# EAGLE design 156-01A LCNC Combo board (EAGLE 6.6.0)

## Sheet 1 of 2
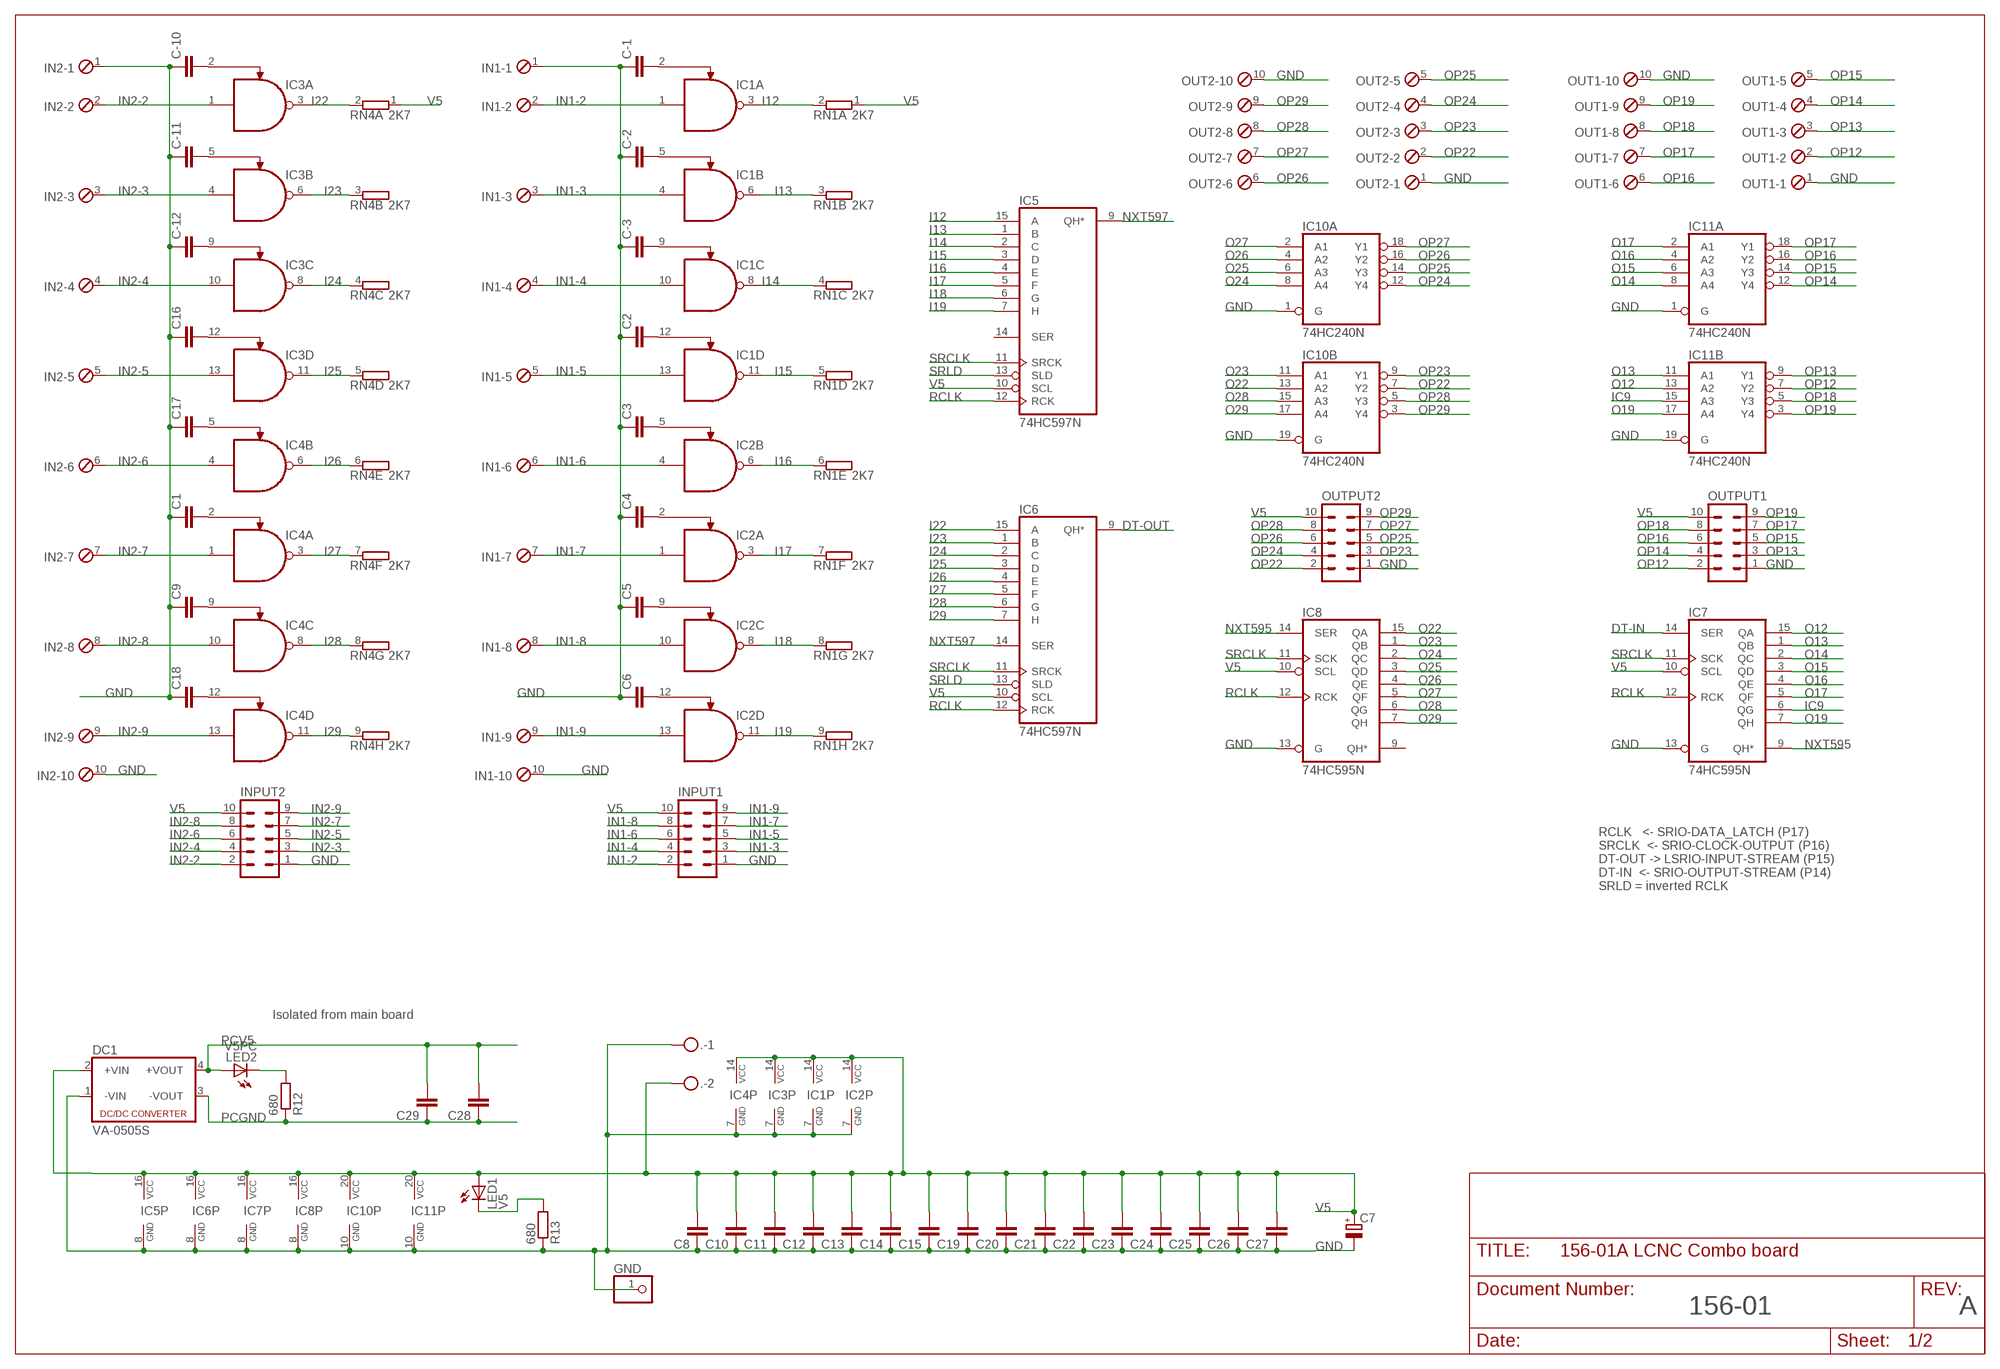
[diagram p0: schematic, sheet 1]

### Parts
.  MKDSN1,5/2-5,08  [MKDSN1,5/2-5,08]
C1  C-EU025-024X044  [C025-024X044]
C2  C-EU025-024X044  [C025-024X044]
C3  C-EU025-024X044  [C025-024X044]
C4  C-EU025-024X044  [C025-024X044]
C5  C-EU025-024X044  [C025-024X044]
C6  C-EU025-024X044  [C025-024X044]
C7  CPOL-EUE3.5-8  [E3,5-8]
C8  C-EU025-024X044  [C025-024X044]
C9  C-EU025-024X044  [C025-024X044]
C10  C-EU025-024X044  [C025-024X044]
C11  C-EU025-024X044  [C025-024X044]
C12  C-EU025-024X044  [C025-024X044]
C13  C-EU025-024X044  [C025-024X044]
C14  C-EU025-024X044  [C025-024X044]
C15  C-EU025-024X044  [C025-024X044]
C16  C-EU025-024X044  [C025-024X044]
C17  C-EU025-024X044  [C025-024X044]
C18  C-EU025-024X044  [C025-024X044]
C19  C-EU025-024X044  [C025-024X044]
C20  C-EU025-024X044  [C025-024X044]
C21  C-EU025-024X044  [C025-024X044]
C22  C-EU025-024X044  [C025-024X044]
C23  C-EU025-024X044  [C025-024X044]
C24  C-EU025-024X044  [C025-024X044]
C25  C-EU025-024X044  [C025-024X044]
C26  C-EU025-024X044  [C025-024X044]
C27  C-EU025-024X044  [C025-024X044]
C28  C-EU025-024X044  [C025-024X044]
C29  C-EU025-024X044  [C025-024X044]
C-1  C-EU025-024X044  [C025-024X044]
C-2  C-EU025-024X044  [C025-024X044]
C-3  C-EU025-024X044  [C025-024X044]
C-10  C-EU025-024X044  [C025-024X044]
C-11  C-EU025-024X044  [C025-024X044]
C-12  C-EU025-024X044  [C025-024X044]
DC1  VA-0505S  [4SIL]
GND  PINHD-1X1  [1X01]
IC1  MC1489DIP  [DIL14]
IC2  MC1489DIP  [DIL14]
IC3  MC1489DIP  [DIL14]
IC4  MC1489DIP  [DIL14]
IC5  74HC597N  [DIL16]
IC6  74HC597N  [DIL16]
IC7  74HC595N  [DIL16]
IC8  74HC595N  [DIL16]
IC10  74HC240N  [DIL20]
IC11  74HC240N  [DIL20]
IN1  MPT10  [10POL254]
IN2  MPT10  [10POL254]
INPUT1  ML10  [ML10]
INPUT2  ML10  [ML10]
LED1  V5  LED3MM  [LED3MM]
LED2  V5PC  LED3MM  [LED3MM]
OUT1  MPT10  [10POL254]
OUT2  MPT10  [10POL254]
OUTPUT1  ML10  [ML10]
OUTPUT2  ML10  [ML10]
R12  680  R-EU_0207/10  [0207/10]
R13  680  R-EU_0207/10  [0207/10]
RN1  2K7  GE08R  [SIL9]
RN4  2K7  GE08R  [SIL9]

### Nets
DT-IN: IC7.14(SER) ; also sheet 2
DT-OUT: IC6.9(QH*) ; also sheet 2
GND: ..1 C1.1 C2.1 C3.1 C4.1 C5.1 C6.1 C7.- C8.1 C9.1 C10.1 C11.1 C12.1 C13.1 C14.1 C15.1 C16.1 C17.1 C18.1 C19.1 C20.1 C21.1 C22.1 C23.1 C24.1 C25.1 C26.1 C27.1 C-1.1 C-2.1 C-3.1 C-10.1 C-11.1 C-12.1 DC1.1(-VIN) GND.1 IC1.7(P:GND) IC2.7(P:GND) IC3.7(P:GND) IC4.7(P:GND) IC5.8(GND) IC6.8(GND) IC7.8(GND) IC7.13(G) IC8.8(GND) IC8.13(G) IC10.1(A:G) IC10.10(P:GND) IC10.19(B:G) IC11.1(A:G) IC11.10(P:GND) IC11.19(B:G) IN1.1 IN1.10 IN2.1 IN2.10 INPUT1.1 INPUT2.1 OUT1.1 OUT1.10 OUT2.1 OUT2.10 OUTPUT1.1 OUTPUT2.1 R13.1 ; also sheet 2
I12: IC1.3(A:O) IC5.15(A) RN1.2
I13: IC1.6(B:O) IC5.1(B) RN1.3
I14: IC1.8(C:O) IC5.2(C) RN1.4
I15: IC1.11(D:O) IC5.3(D) RN1.5
I16: IC2.6(B:O) IC5.4(E) RN1.6
I17: IC2.3(A:O) IC5.5(F) RN1.7
I18: IC2.8(C:O) IC5.6(G) RN1.8
I19: IC2.11(D:O) IC5.7(H) RN1.9
I22: IC3.3(A:O) IC6.15(A) RN4.2
I23: IC3.6(B:O) IC6.1(B) RN4.3
I24: IC3.8(C:O) IC6.2(C) RN4.4
I25: IC3.11(D:O) IC6.3(D) RN4.5
I26: IC4.6(B:O) IC6.4(E) RN4.6
I27: IC4.3(A:O) IC6.5(F) RN4.7
I28: IC4.8(C:O) IC6.6(G) RN4.8
I29: IC4.11(D:O) IC6.7(H) RN4.9
IC9: IC7.6(QG) IC11.15(B:A3)
IN1-2: IC1.1(A:I0) IN1.2 INPUT1.2
IN1-3: IC1.4(B:I0) IN1.3 INPUT1.3
IN1-4: IC1.10(C:I0) IN1.4 INPUT1.4
IN1-5: IC1.13(D:I0) IN1.5 INPUT1.5
IN1-6: IC2.4(B:I0) IN1.6 INPUT1.6
IN1-7: IC2.1(A:I0) IN1.7 INPUT1.7
IN1-8: IC2.10(C:I0) IN1.8 INPUT1.8
IN1-9: IC2.13(D:I0) IN1.9 INPUT1.9
IN2-2: IC3.1(A:I0) IN2.2 INPUT2.2
IN2-3: IC3.4(B:I0) IN2.3 INPUT2.3
IN2-4: IC3.10(C:I0) IN2.4 INPUT2.4
IN2-5: IC3.13(D:I0) IN2.5 INPUT2.5
IN2-6: IC4.4(B:I0) IN2.6 INPUT2.6
IN2-7: IC4.1(A:I0) IN2.7 INPUT2.7
IN2-8: IC4.10(C:I0) IN2.8 INPUT2.8
IN2-9: IC4.13(D:I0) IN2.9 INPUT2.9
N$1: C-2.2 IC1.5(B:I1)
N$3: C-10.2 IC3.2(A:I1)
N$5: C17.2 IC4.5(B:I1)
N$7: C-3.2 IC1.9(C:I1)
N$10: C1.2 IC4.2(A:I1)
N$11: C9.2 IC4.9(C:I1)
N$12: C18.2 IC4.12(D:I1)
N$19: C2.2 IC1.12(D:I1)
N$20: C4.2 IC2.2(A:I1)
N$21: C5.2 IC2.9(C:I1)
N$22: C6.2 IC2.12(D:I1)
N$23: C-1.2 IC1.2(A:I1)
N$24: C3.2 IC2.5(B:I1)
N$27: LED2.K(C) R12.2
N$28: LED1.K(C) R13.2
N$39: C-11.2 IC3.5(B:I1)
N$40: C-12.2 IC3.9(C:I1)
N$42: C16.2 IC3.12(D:I1)
NXT595: IC7.9(QH*) IC8.14(SER)
NXT597: IC5.9(QH*) IC6.14(SER)
O12: IC7.15(QA) IC11.13(B:A2)
O13: IC7.1(QB) IC11.11(B:A1)
O14: IC7.2(QC) IC11.8(A:A4)
O15: IC7.3(QD) IC11.6(A:A3)
O16: IC7.4(QE) IC11.4(A:A2)
O17: IC7.5(QF) IC11.2(A:A1)
O19: IC7.7(QH) IC11.17(B:A4)
O22: IC8.15(QA) IC10.13(B:A2)
O23: IC8.1(QB) IC10.11(B:A1)
O24: IC8.2(QC) IC10.8(A:A4)
O25: IC8.3(QD) IC10.6(A:A3)
O26: IC8.4(QE) IC10.4(A:A2)
O27: IC8.5(QF) IC10.2(A:A1)
O28: IC8.6(QG) IC10.15(B:A3)
O29: IC8.7(QH) IC10.17(B:A4)
OP12: IC11.7(B:Y2) OUT1.2 OUTPUT1.2
OP13: IC11.9(B:Y1) OUT1.3 OUTPUT1.3
OP14: IC11.12(A:Y4) OUT1.4 OUTPUT1.4
OP15: IC11.14(A:Y3) OUT1.5 OUTPUT1.5
OP16: IC11.16(A:Y2) OUT1.6 OUTPUT1.6
OP17: IC11.18(A:Y1) OUT1.7 OUTPUT1.7
OP18: IC11.5(B:Y3) OUT1.8 OUTPUT1.8
OP19: IC11.3(B:Y4) OUT1.9 OUTPUT1.9
OP22: IC10.7(B:Y2) OUT2.2 OUTPUT2.2
OP23: IC10.9(B:Y1) OUT2.3 OUTPUT2.3
OP24: IC10.12(A:Y4) OUT2.4 OUTPUT2.4
OP25: IC10.14(A:Y3) OUT2.5 OUTPUT2.5
OP26: IC10.16(A:Y2) OUT2.6 OUTPUT2.6
OP27: IC10.18(A:Y1) OUT2.7 OUTPUT2.7
OP28: IC10.5(B:Y3) OUT2.8 OUTPUT2.8
OP29: IC10.3(B:Y4) OUT2.9 OUTPUT2.9
PCGND: C28.1 C29.1 DC1.3(-VOUT) R12.1 ; also sheet 2
PCV5: C28.2 C29.2 DC1.4(+VOUT) LED2.A ; also sheet 2
RCLK: IC5.12(RCK) IC6.12(RCK) IC7.12(RCK) IC8.12(RCK) ; also sheet 2
SRCLK: IC5.11(SRCK) IC6.11(SRCK) IC7.11(SCK) IC8.11(SCK) ; also sheet 2
SRLD: IC5.13(SLD) IC6.13(SLD) ; also sheet 2
V5: ..2 C7.+ C8.2 C10.2 C11.2 C12.2 C13.2 C14.2 C15.2 C19.2 C20.2 C21.2 C22.2 C23.2 C24.2 C25.2 C26.2 C27.2 DC1.2(+VIN) IC1.14(P:VCC) IC2.14(P:VCC) IC3.14(P:VCC) IC4.14(P:VCC) IC5.10(SCL) IC5.16(VCC) IC6.10(SCL) IC6.16(VCC) IC7.10(SCL) IC7.16(VCC) IC8.10(SCL) IC8.16(VCC) IC10.20(P:VCC) IC11.20(P:VCC) INPUT1.10 INPUT2.10 LED1.A OUTPUT1.10 OUTPUT2.10 RN1.1 RN4.1 ; also sheet 2
Unconnected: IC5.14(SER) IC8.9(QH*)

### Notes on the sheet
- RCLK   <- SRIO-DATA_LATCH (P17)
  SRCLK  <- SRIO-CLOCK-OUTPUT (P16)
  DT-OUT -> LSRIO-INPUT-STREAM (P15)
  DT-IN  <- SRIO-OUTPUT-STREAM (P14)
  SRLD = inverted RCLK
- Isolated from main board
- 156-01 | A

## Sheet 2 of 2
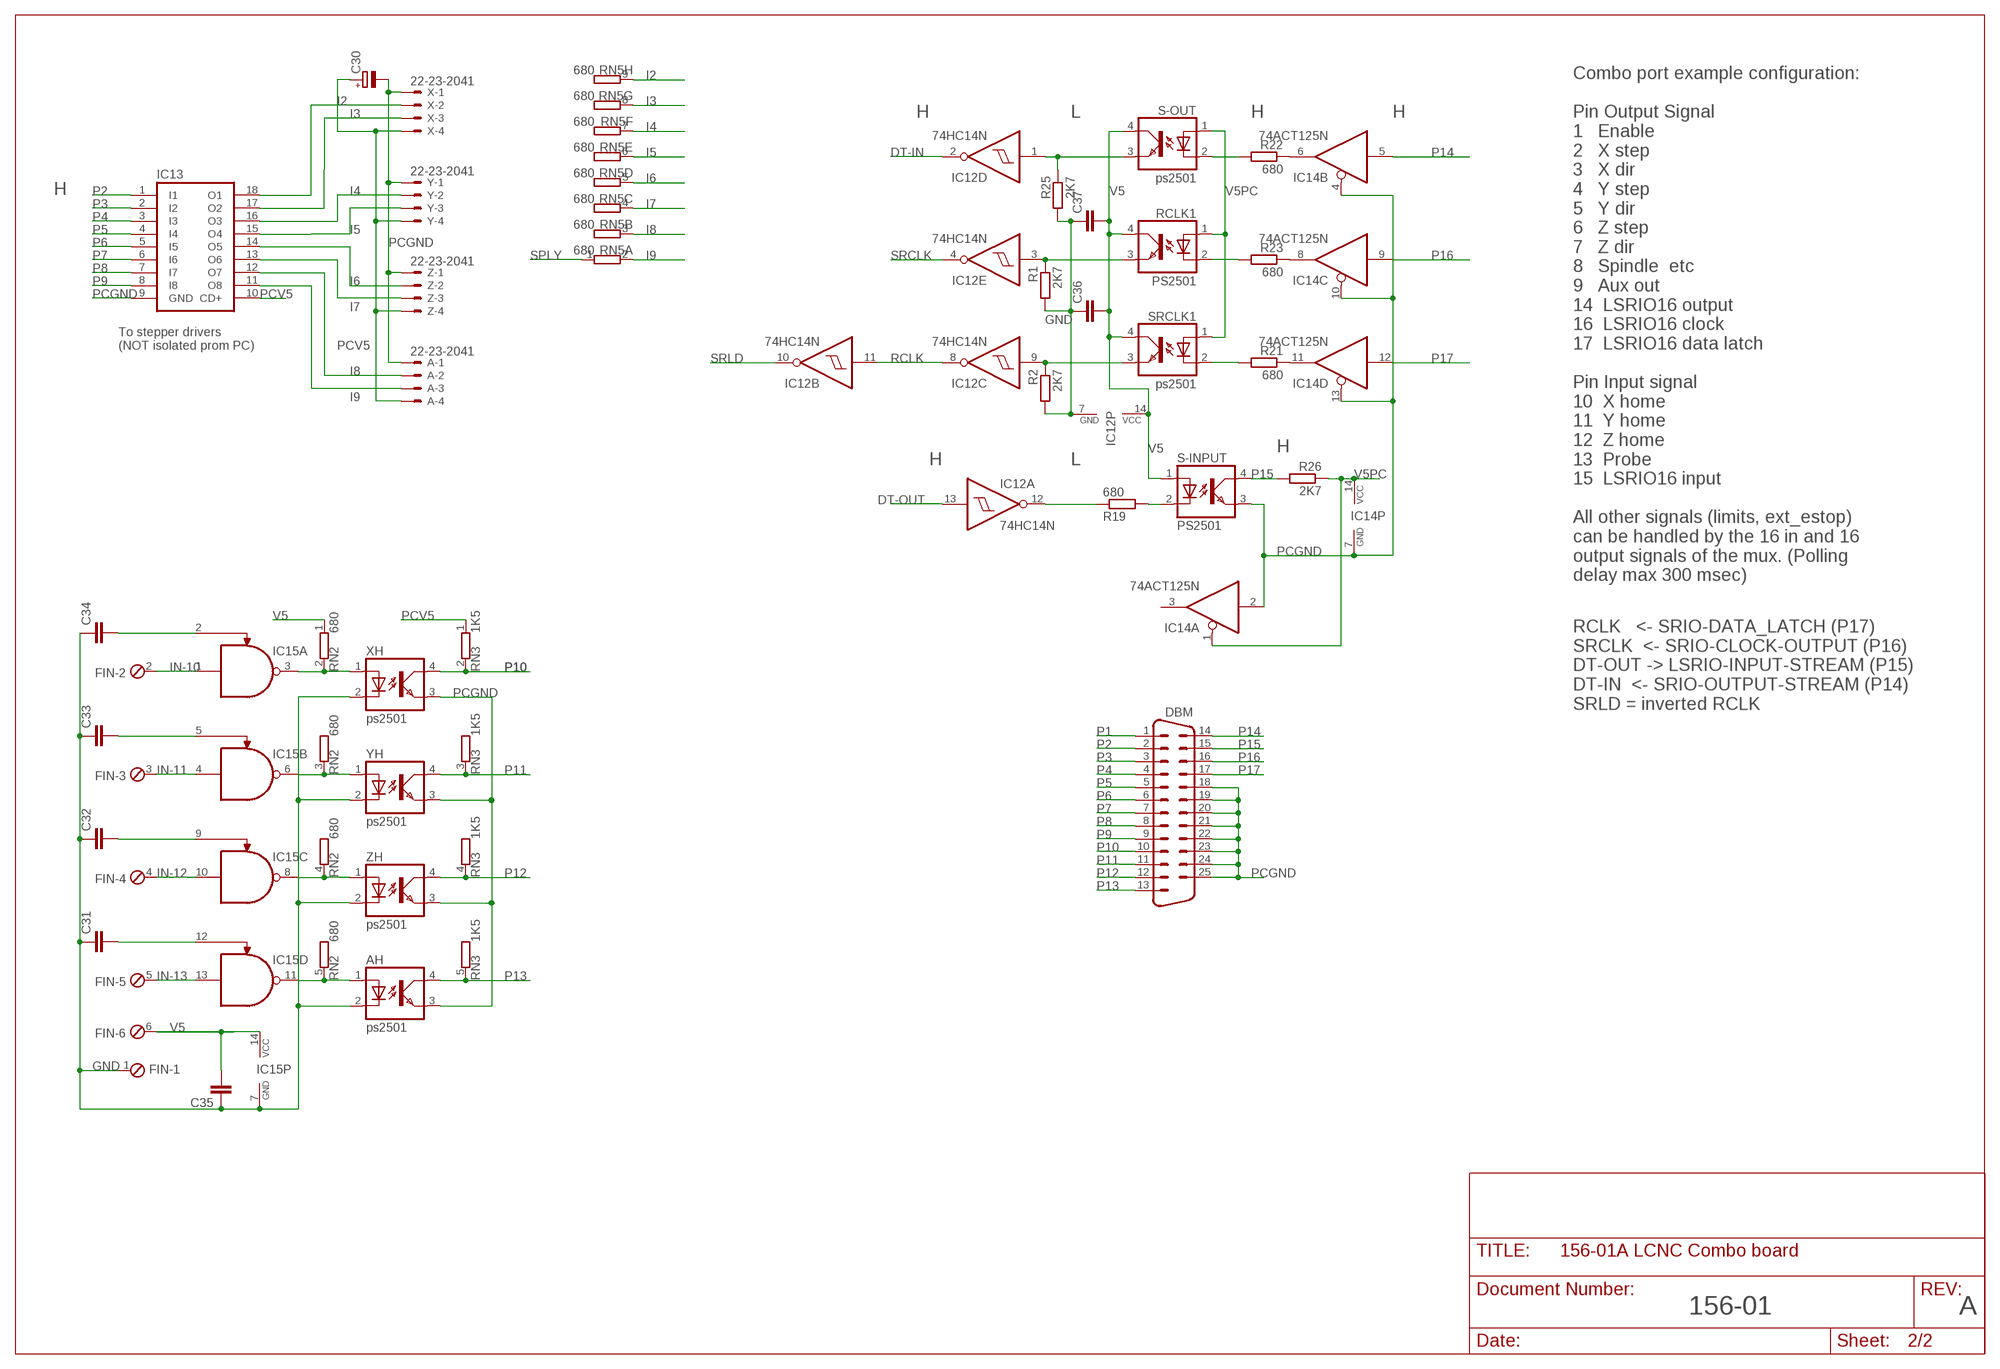
[diagram p1: schematic, sheet 2]

### Parts
A  22-23-2041  [22-23-2041]
AH  ps2501  PC817  [DIL04]
C30  CPOL-EUE2.5-6  [E2,5-6]
C31  C-EU025-024X044  [C025-024X044]
C32  C-EU025-024X044  [C025-024X044]
C33  C-EU025-024X044  [C025-024X044]
C34  C-EU025-024X044  [C025-024X044]
C35  C-EU025-024X044  [C025-024X044]
C36  C-EU025-024X044  [C025-024X044]
C37  C-EU025-024X044  [C025-024X044]
DBM  M25HP  [M25HP]
FIN  MPT6  [6POL254]
IC12  74HC14N  [DIL14]
IC13  ULN2803A  [DIL18]
IC14  74ACT125N  [DIL14]
IC15  MC1489DIP  [DIL14]
R1  2K7  R-EU_0207/10  [0207/10]
R2  2K7  R-EU_0207/10  [0207/10]
R19  680  R-EU_0207/10  [0207/10]
R21  680  R-EU_0207/10  [0207/10]
R22  680  R-EU_0207/10  [0207/10]
R23  680  R-EU_0207/10  [0207/10]
R25  2K7  R-EU_0207/10  [0207/10]
R26  2K7  R-EU_0207/10  [0207/10]
RCLK1  PS2501  PC817  [DIL04]
RN2  680  GE04RP  [SIL5]
RN3  1K5  GE04RP  [SIL5]
RN5  680  GE08R  [SIL9]
S-INPUT  PS2501  PC817  [DIL04]
S-OUT  ps2501  PC817  [DIL04]
SRCLK1  ps2501  PC817  [DIL04]
X  22-23-2041  [22-23-2041]
XH  ps2501  PC817  [DIL04]
Y  22-23-2041  [22-23-2041]
YH  ps2501  PC817  [DIL04]
Z  22-23-2041  [22-23-2041]
ZH  ps2501  PC817  [DIL04]

### Nets
DT-IN: IC12.2(D:O) ; also sheet 1
DT-OUT: IC12.13(A:I) ; also sheet 1
GND: AH.2(C) C31.1 C32.1 C33.1 C34.1 C35.1 C36.1 C37.1 FIN.1 IC12.7(P:GND) IC15.7(P:GND) R1.2 R2.2 R25.2 XH.2(C) YH.2(C) ZH.2(C) ; also sheet 1
I2: IC13.18(O1) RN5.9 X.2
I3: IC13.17(O2) RN5.8 X.3
I4: IC13.16(O3) RN5.7 Y.2
I5: IC13.15(O4) RN5.6 Y.3
I6: IC13.14(O5) RN5.5 Z.2
I7: IC13.13(O6) RN5.4 Z.3
I8: A.2 IC13.12(O7) RN5.3
I9: A.3 IC13.11(O8) RN5.2
IN-10: FIN.2 IC15.1(A:I0)
IN-11: FIN.3 IC15.4(B:I0)
IN-12: FIN.4 IC15.10(C:I0)
IN-13: FIN.5 IC15.13(D:I0)
N$2: IC15.3(A:O) RN2.2 XH.1(A)
N$4: IC14.6(B:O) R22.1
N$6: IC15.8(C:O) RN2.4 ZH.1(A)
N$8: AH.1(A) IC15.11(D:O) RN2.5
N$9: C33.2 IC15.5(B:I1)
N$13: C34.2 IC15.2(A:I1)
N$14: C32.2 IC15.9(C:I1)
N$15: C31.2 IC15.12(D:I1)
N$26: IC15.6(B:O) RN2.3 YH.1(A)
N$29: R22.2 S-OUT.2(C)
N$30: IC12.3(E:I) R1.1 RCLK1.3(EMIT)
N$31: R23.2 RCLK1.2(C)
N$32: IC12.1(D:I) R25.1 S-OUT.3(EMIT)
N$33: IC12.9(C:I) R2.1 SRCLK1.3(EMIT)
N$35: R21.2 SRCLK1.2(C)
N$43: IC12.12(A:O) R19.1
N$54: IC14.11(D:O) R21.1
N$56: IC14.8(C:O) R23.1
N$59: R19.2 S-INPUT.2(C)
P1: DBM.1
P2: DBM.2 IC13.1(I1)
P3: DBM.3 IC13.2(I2)
P4: DBM.4 IC13.3(I3)
P5: DBM.5 IC13.4(I4)
P6: DBM.6 IC13.5(I5)
P7: DBM.7 IC13.6(I6)
P8: DBM.8 IC13.7(I7)
P9: DBM.9 IC13.8(I8)
P10: DBM.10 RN3.2 XH.4(COL)
P11: DBM.11 RN3.3 YH.4(COL)
P12: DBM.12 RN3.4 ZH.4(COL)
P13: AH.4(COL) DBM.13 RN3.5
P14: DBM.14 IC14.5(B:I)
P15: DBM.15 R26.2 S-INPUT.4(COL)
P16: DBM.16 IC14.9(C:I)
P17: DBM.17 IC14.12(D:I)
PCGND: A.1 AH.3(EMIT) C30.- DBM.18 DBM.19 DBM.20 DBM.21 DBM.22 DBM.23 DBM.24 DBM.25 IC13.9(GND) IC14.2(A:I) IC14.4(B:OE) IC14.7(P:GND) IC14.10(C:OE) IC14.13(D:OE) S-INPUT.3(EMIT) X.1 XH.3(EMIT) Y.1 YH.3(EMIT) Z.1 ZH.3(EMIT) ; also sheet 1
PCV5: A.4 C30.+ IC13.10(CD+) RN3.1 X.4 Y.4 Z.4 ; also sheet 1
RCLK: IC12.8(C:O) IC12.11(B:I) ; also sheet 1
SPLY: RN5.1
SRCLK: IC12.4(E:O) ; also sheet 1
SRLD: IC12.10(B:O) ; also sheet 1
V5: C35.2 C36.2 C37.2 FIN.6 IC12.14(P:VCC) IC15.14(P:VCC) RCLK1.4(COL) RN2.1 S-INPUT.1(A) S-OUT.4(COL) SRCLK1.4(COL) ; also sheet 1
V5PC: IC14.1(A:OE) IC14.14(P:VCC) R26.1 RCLK1.1(A) S-OUT.1(A) SRCLK1.1(A)
Unconnected: IC12.5(F:I) IC12.6(F:O) IC14.3(A:O)

### Notes on the sheet
- H | L | H | H
- H
- To stepper drivers
  (NOT isolated prom PC)
- H
- H | L
- Combo port example configuration:
  
  Pin Output Signal
  1   Enable
  2   X step
  3   X dir
  4   Y step
  5   Y dir
  6   Z step
  7   Z dir
  8   Spindle  etc
  9   Aux out
  14  LSRIO16 output
  16  LSRIO16 clock
  17  LSRIO16 data latch
  
  Pin Input signal
  10  X home
  11  Y home
  12  Z home
  13  Probe
  15  LSRIO16 input
  
  All other signals (limits, ext_estop)
  can be handled by the 16 in and 16
  output signals of the mux. (Polling
  delay max 300 msec)
- RCLK   <- SRIO-DATA_LATCH (P17)
  SRCLK  <- SRIO-CLOCK-OUTPUT (P16)
  DT-OUT -> LSRIO-INPUT-STREAM (P15)
  DT-IN  <- SRIO-OUTPUT-STREAM (P14)
  SRLD = inverted RCLK
- 156-01 | A

## Library data of the parts
. = con-phoenix-508:MKDSN1,5/2-5,08: MKDSN 1,5/ 2-5,08 Printklemme Nennstrom: 13,5 A Nennspannung: 250 V Rastermaß: 5,08 mm Polzahl: 2 Anschlussart: Schraubanschluss Montage: Löten Anschlussrichtung Leiter/Platine: 0 ° Artikelnummer: 1729128 Source: http://eshop.phoenixcontact.com .. 1729128.pdf
A X Y Z = con-molex:22-23-2041: .100" (2.54mm) Center Header - 4 Pin; MF: MOLEX; MPN: 22-23-2041; OC_FARNELL: 1462920; OC_NEWARK: 38C0355
AH RCLK1 S-INPUT S-OUT SRCLK1 XH YH ZH = optocoupler:PC817: SHARP OPTO COUPLER; MPN: PC817X4J000F; OC_FARNELL: 9707727; OC_NEWARK: 97K7059
C1-C6 C8-C29 C31-C37 C-1-C-3 C-10-C-12 = rcl:C-EU: CAPACITOR, European symbol
C7 C30 = rcl:CPOL-EU: POLARIZED CAPACITOR, European symbol
DBM = my-components:M25: SUB-D; OC_FARNELL: unknown; OC_NEWARK: unknown
DC1 = dc-dc-converter:VA-*?: DC DC Converter Single Output, 1 Watt Motien Technology Co.,Ltd. Source: Data sheet <http://www.motien.com.tw/data_sheet/VA-1%28H%29.pdf>; OC_FARNELL: unknown; OC_NEWARK: unknown
FIN = con-phoenix-254:MPT6: PHOENIX CONNECTOR; OC_FARNELL: unknown; OC_NEWARK: unknown
GND = pinhead:PINHD-1X1: PIN HEADER
IC1-IC4 = My components:MC1489DIP: MC1489 quad line receiver DIP14
IC5 IC6 = 74xx-eu:74*597: 8-bit SHIFT REGISTER, input latch
IC7 IC8 = 74xx-eu:74*595: 8-bit SHIFT REGISTER, output latch
IC10 IC11 = 74xx-eu:74*240: Octal BUFFER and LINE DRIVER, 3-state
IC12 = 74xx-eu:74*14: Hex schmitt trigger INVERTER
IC13 = uln-udn:ULN2803A: DRIVER ARRAY
IC14 = 74xx-eu:74*125: Quad bus BUFFER, 3-state
IC15 = my-components:MC1489DIP: MC1489 quad line receiver DIP14
IN1 IN2 OUT1 OUT2 = con-phoenix-254:MPT10: PHOENIX CONNECTOR; OC_FARNELL: unknown; OC_NEWARK: unknown
INPUT1 INPUT2 OUTPUT1 OUTPUT2 = con-harting-ml:ML10: HARTING; OC_FARNELL: unknown; OC_NEWARK: unknown
LED1 LED2 = led:LED: LED OSRAM: - CHIPLED LG R971, LG N971, LY N971, LG Q971, LY Q971, LO R971, LY R971 LH N974, LH R974 LS Q976, LO Q976, LY Q976 LO Q996 - Hyper CHIPLED LW Q18S LB Q993, LB Q99A, LB R99A - SideLED LS A670, LO A670, LY A670, LG A670, LP A670 LB A673, LV A673, LT A673, LW A673 LH A674 LY A675 LS A676, LA A676, LO A676, LY A676, LW A676 LS A679, LY A679, LG A679 - Hyper Micro SIDELED® LS Y876, LA Y876, LO Y876, LY Y876 LT Y87S - SmartLED LW L88C, LW L88S LB L89C, LB L89S, LG L890 LS L89K, LO L89K, LY L89K LS L896, LA L896, LO L896, LY L896 - TOPLED LS T670, LO T670, LY T670, LG T670, LP T670 LSG T670, LSP T670, LSY T670, LOP T670, LYG T670 LG T671, LOG T671, LSG T671 LB T673, LV T673, LT T673, LW T673 LH T674 LS T676, LA T676, LO T676, LY T676, LB T676, LH T676, LSB T676, LW T676 LB T67C, LV T67C, LT T67C, LS T67K, LO T67K, LY T67K, LW E67C LS E67B, LA E67B, LO E67B, LY E67B, LB E67C, LV E67C, LT E67C LW T67C LS T679, LY T679, LG T679 LS T770, LO T770, LY T770, LG T770, LP T770 LB T773, LV T773, LT T773, LW T773 LH T774 LS E675, LA E675, LY E675, LS T675 LS T776, LA T776, LO T776, LY T776, LB T776 LHGB T686 LT T68C, LB T68C - Hyper Mini TOPLED® LB M676 - Mini TOPLED Santana® LG M470 LS M47K, LO M47K, LY M47K Source: http://www.osram.convergy.de LUXEON: - LUMILED® LXK2-PW12-R00, LXK2-PW12-S00, LXK2-PW14-U00, LXK2-PW14-V00 LXK2-PM12-R00, LXK2-PM12-S00, LXK2-PM14-U00 LXK2-PE12-Q00, LXK2-PE12-R00, LXK2-PE12-S00, LXK2-PE14-T00, LXK2-PE14-U00 LXK2-PB12-K00, LXK2-PB12-L00, LXK2-PB12-M00, LXK2-PB14-N00, LXK2-PB14-P00, LXK2-PB14-Q00 LXK2-PR12-L00, LXK2-PR12-M00, LXK2-PR14-Q00, LXK2-PR14-R00 LXK2-PD12-Q00, LXK2-PD12-R00, LXK2-PD12-S00 LXK2-PH12-R00, LXK2-PH12-S00 LXK2-PL12-P00, LXK2-PL12-Q00, LXK2-PL12-R00 Source: www.luxeon.com KINGBRIGHT: KA-3528ASYC Source: www.kingbright.com
R1 R2 R12 R13 R19 R21-R23 R25 R26 = rcl:R-EU_: RESISTOR, European symbol
RN1 RN4 RN5 = resistor-sil:GE08R: SIL RESISTOR; OC_FARNELL: unknown; OC_NEWARK: unknown
RN2 RN3 = resistor-sil:GE04RP: SIL RESISTOR; OC_FARNELL: unknown; OC_NEWARK: unknown

## Board
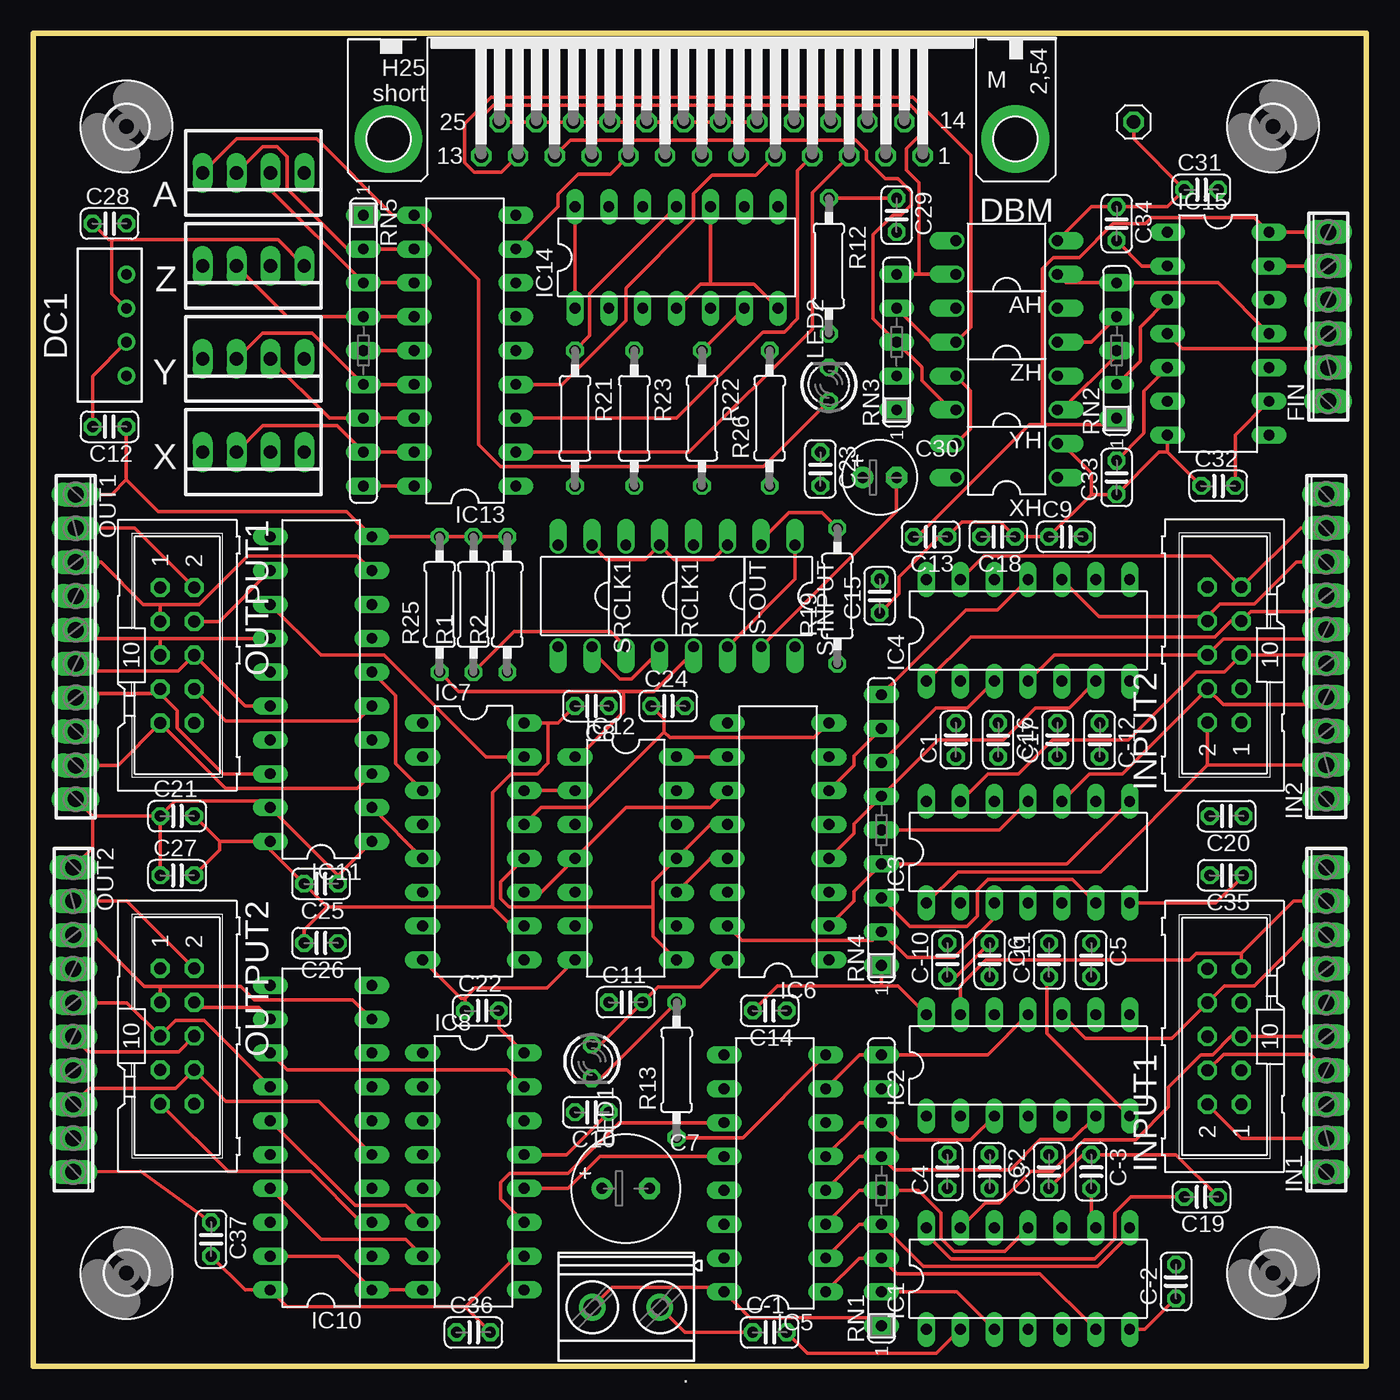
[diagram p2: board, top side]
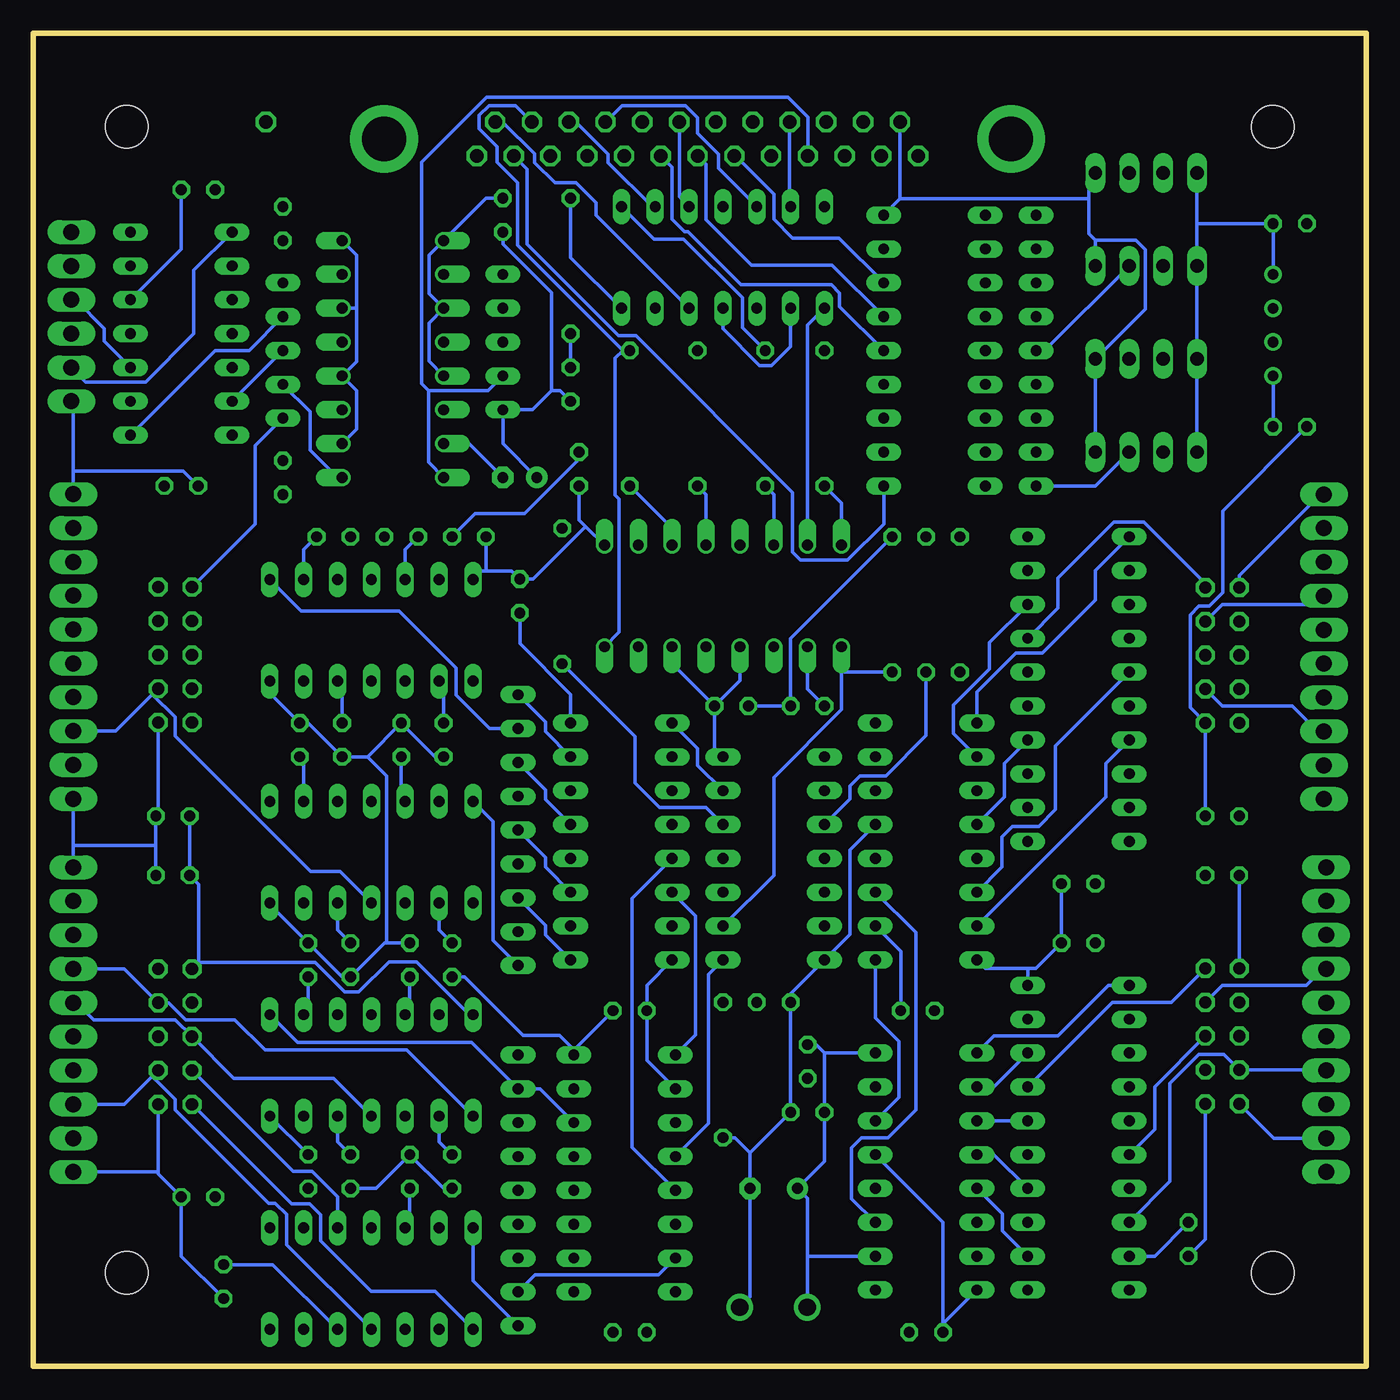
[diagram p3: board, bottom side, seen from below]

Size 100 x 100 mm. Coordinates in mm from the lower left corner, seen from the top.
Outline: 100,100 100,0 0,0 0,100 100,100
Copper layers (1*16): Top 0.035mm / dielectric 1.5mm / Bottom 0.035mm
Design rules "default *": minimum track width 10mil, minimum drill 24mil, track to track 12mil, track to pad 12mil, pad to pad 15mil, via to via 8mil, smd to smd 8mil, copper to edge 20mil, drill to drill 15mil, minimum pad ring 10mil, minimum via ring 8mil, stop-mask expansion 4mil, vias tented up to drill 0mil, thermal gap 10mil

### Footprints (pad centres in the part's own frame; a part is rotated, then mirrored left to right if it is on the bottom)
MKDSN1,5/2-5,08 = drill 1.3 pad 2: 1 -2.561,0.025; 2 2.519,0.025
22-23-2041 = drill 1 long: 1 -3.81,0; 2 -1.27,0; 3 1.27,0; 4 3.81,0
DIL04 = drill 0.813 offset: 1 -1.27,-3.81; 2 1.27,-3.81; 3 1.27,3.81; 4 -1.27,3.81
C025-024X044 = drill 0.813 octagon: 1 -1.27,0; 2 1.27,0
E3,5-8 = drill 0.813 pad 1.6: + -1.778,0 | drill 0.813 pad 1.6 octagon: - 1.778,0
E2,5-6 = drill 0.813 pad 1.6: + -1.27,0 | drill 0.813 pad 1.6 octagon: - 1.27,0
M25HP = drill 1.016 octagon: 1 -16.561,1.27; 2 -13.792,1.27; 3 -11.049,1.27; 4 -8.28,1.27; 5 -5.512,1.27; 6 -2.769,1.27; 7 0,1.27; 8 2.769,1.27; 9 5.512,1.27; 10 8.28,1.27; 11 11.049,1.27; 12 13.792,1.27; 13 16.561,1.27; 14 -15.189,-1.27; 15 -12.421,-1.27; 16 -9.652,-1.27; 17 -6.909,-1.27; 18 -4.14,-1.27; 19 -1.372,-1.27; 20 1.372,-1.27; 21 4.14,-1.27; 22 6.909,-1.27; 23 9.652,-1.27; 24 12.421,-1.27; 25 15.189,-1.27 | drill 3.302 pad 5.08: G1 -23.52,0; G2 23.52,0
4SIL = drill 0.8: 1 -3.81,0; 2 -1.27,0; 3 1.27,0; 4 3.81,0
6POL254 = drill 1.2 pad 1.778 long: 1 -6.35,0; 2 -3.81,0; 3 -1.27,0; 4 1.27,0; 5 3.81,0; 6 6.35,0
1X01 = drill 1.016 octagon: 1 0,0
DIL14 = drill 0.813 long: 1 -7.62,-3.81; 2 -5.08,-3.81; 3 -2.54,-3.81; 4 0,-3.81; 5 2.54,-3.81; 6 5.08,-3.81; 7 7.62,-3.81; 8 7.62,3.81; 9 5.08,3.81; 10 2.54,3.81; 11 0,3.81; 12 -2.54,3.81; 13 -5.08,3.81; 14 -7.62,3.81
DIL16 = drill 0.813 long: 1 -8.89,-3.81; 2 -6.35,-3.81; 3 -3.81,-3.81; 4 -1.27,-3.81; 5 1.27,-3.81; 6 3.81,-3.81; 7 6.35,-3.81; 8 8.89,-3.81; 9 8.89,3.81; 10 6.35,3.81; 11 3.81,3.81; 12 1.27,3.81; 13 -1.27,3.81; 14 -3.81,3.81; 15 -6.35,3.81; 16 -8.89,3.81
DIL20 = drill 0.813 long: 1 -11.43,-3.81; 2 -8.89,-3.81; 3 -6.35,-3.81; 4 -3.81,-3.81; 5 -1.27,-3.81; 6 1.27,-3.81; 7 3.81,-3.81; 8 6.35,-3.81; 9 8.89,-3.81; 10 11.43,-3.81; 11 11.43,3.81; 12 8.89,3.81; 13 6.35,3.81; 14 3.81,3.81; 15 1.27,3.81; 16 -1.27,3.81; 17 -3.81,3.81; 18 -6.35,3.81; 19 -8.89,3.81; 20 -11.43,3.81
DIL18 = drill 0.813 long: 1 -10.16,-3.81; 2 -7.62,-3.81; 3 -5.08,-3.81; 4 -2.54,-3.81; 5 0,-3.81; 6 2.54,-3.81; 7 5.08,-3.81; 8 7.62,-3.81; 9 10.16,-3.81; 10 10.16,3.81; 11 7.62,3.81; 12 5.08,3.81; 13 2.54,3.81; 14 0,3.81; 15 -2.54,3.81; 16 -5.08,3.81; 17 -7.62,3.81; 18 -10.16,3.81
10POL254 = drill 1.2 long: 1 -11.43,0; 2 -8.89,0; 3 -6.35,0; 4 -3.81,0; 5 -1.27,0; 6 1.27,0; 7 3.81,0; 8 6.35,0; 9 8.89,0; 10 11.43,0
ML10 = drill 0.914 octagon: 1 -5.08,-1.27; 2 -5.08,1.27; 3 -2.54,-1.27; 4 -2.54,1.27; 5 0,-1.27; 6 0,1.27; 7 2.54,-1.27; 8 2.54,1.27; 9 5.08,-1.27; 10 5.08,1.27
LED3MM = drill 0.813 octagon: A -1.27,0; K 1.27,0
0207/10 = drill 0.813 octagon: 1 -5.08,0; 2 5.08,0
SIL9 = drill 0.813 long: 1 -10.16,0; 2 -7.62,0; 3 -5.08,0; 4 -2.54,0; 5 0,0; 6 2.54,0; 7 5.08,0; 8 7.62,0; 9 10.16,0
SIL5 = drill 0.813 long: 1 -5.08,0; 2 -2.54,0; 3 0,0; 4 2.54,0; 5 5.08,0
3,2 = hole 3.2: 0,0

### Placement (x,y rotation side)
.  44.45,4.45 180 top
A  16.51,89.53 180 top
AH  73.03,83.19 90 top
C1  69.22,46.99 90 top
C2  71.75,14.61 270 top
C3  76.2,14.61 90 top
C4  68.58,14.61 90 top
C5  79.38,30.48 270 top
C6  71.75,30.48 270 top
C7  44.45,13.34 0 top
C8  41.91,49.53 180 top
C9  77.47,62.23 0 top
C10  41.91,19.05 180 top
C11  44.45,27.3 0 top
C12  5.71,70.48 180 top
C13  67.31,62.23 180 top
C14  55.24,26.67 180 top
C15  63.5,57.78 90 top
C16  72.39,46.99 270 top
C17  76.83,46.99 90 top
C18  72.39,62.23 180 top
C19  87.63,12.7 180 top
C20  89.53,41.27 180 top
C21  10.79,41.27 0 top
C22  33.66,26.67 0 top
C23  59.05,67.31 270 top
C24  47.62,49.53 0 top
C25  21.59,36.2 180 top
C26  21.59,31.75 180 top
C27  10.79,36.83 0 top
C28  5.71,85.72 0 top
C29  64.77,86.36 270 top
C30  63.5,66.67 0 top
C31  87.63,88.27 0 top
C32  88.9,66.04 0 top
C33  81.28,66.67 90 top
C34  81.28,85.72 270 top
C35  89.53,36.83 180 top
C36  33.02,2.54 0 top
C37  13.34,9.53 270 top
C-1  55.24,2.54 0 top
C-2  85.72,6.35 90 top
C-3  79.38,14.61 270 top
C-10  68.58,30.48 90 top
C-11  76.2,30.48 90 top
C-12  80.01,46.99 270 top
DBM  50.16,92.08 180 top
DC1  6.99,78.11 90 top
FIN  97.16,78.74 90 top
GND  82.55,93.34 0 top
IC1  74.64,6.57 0 top
IC2  74.64,22.57 0 top
IC3  74.64,38.57 0 top
IC4  74.64,55.2 0 top
IC5  55.63,14.46 90 top
IC6  55.88,39.37 90 top
IC7  33.02,39.37 270 top
IC8  33.02,14.61 270 top
IC10  21.59,17.14 90 top
IC11  21.59,50.8 90 top
IC12  44.45,38.1 270 top
IC13  32.38,76.2 90 top
IC14  48.26,83.19 0 top
IC15  88.9,77.47 270 top
IN1  97,26 90 top
IN2  97,54 90 top
INPUT1  89.36,24.73 90 top
INPUT2  89.36,53.37 90 top
LED1  41.91,22.86 270 top
LED2  59.69,73.66 90 top
OUT1  3.17,53.98 270 top
OUT2  3,26 270 top
OUTPUT1  10.79,53.34 270 top
OUTPUT2  10.79,24.77 270 top
R1  33.02,57.15 90 top
R2  35.56,57.15 90 top
R12  59.69,82.55 270 top
R13  48.26,22.23 90 top
R19  60.33,57.78 90 top
R21  40.64,71.12 270 top
R22  50.16,71.12 270 top
R23  45.09,71.12 270 top
R25  30.48,57.15 90 top
R26  55.24,71.12 90 top
RCLK1  45.72,57.78 180 top
RN1  63.63,13.19 90 top
RN2  81.28,76.2 90 top
RN3  64.77,76.83 90 top
RN4  63.63,40.22 90 top
RN5  24.77,76.2 270 top
S-INPUT  55.88,57.78 180 top
S-OUT  50.8,57.78 180 top
SRCLK1  40.64,57.78 180 top
U$1  [3,2]  7,7 0 top
U$2  [3,2]  93,7 0 top
U$3  [3,2]  93,93 0 top
U$4  [3,2]  7,93 0 top
X  16.51,68.58 180 top
XH  73.03,67.94 90 top
Y  16.51,75.56 180 top
YH  73.03,73.03 90 top
Z  16.51,82.55 180 top
ZH  73.03,78.11 90 top

### Tracks (layer width: path | path; a pad name or v marks a point on that pad's centre or on a via)
DT-IN
  Top 0.254: IC12.2 IC7.14
DT-OUT
  Bottom 0.254: IC12.13 50.16,45.09 50.16,46.35 IC6.9
GND
  Top 0.254: C19.1 85.72,15.88 C-3.1 78.74,15.88 C3.1 | 85.09,68.58 IC15.7 | C32.1 85.09,68.58 | 85.09,68.58 84.45,68.58 C33.1 79.38,65.41 | 32.38,27.61 32.08,27.61 IC7.8 | IC12.7 38.53,28.37 33.15,28.37 32.38,27.61 | 32.38,27.61 C22.1 | 4.45,41.27 OUT1.10 | C21.1 4.45,41.27 | OUT2.1 4.45,38.88 4.45,41.27 | C27.1 C21.1 | IC3.7 88.73,34.76 C35.1 | GND.1 82.55,92.08 C31.1 85.09,87 C34.1 79.38,87 AH.2 | C-10.1 69.22,29.21 C6.1 | 47.33,47.59 41.65,41.91 38.1,41.91 IC7.13 | C24.1 47.33,48.55 47.33,47.59 | IC6.8 58.59,47.16 47.76,47.16 47.33,47.59 | C-11.1 76.05,29.06 76.05,24.96 IC2.7 | 22.86,36.83 C25.1 | IC11.1 22.86,36.83 | 22.86,36.83 IC11.19 17.29,42.4 10.65,42.4 C21.1 | 6.99,66.52 5.87,65.41 OUT1.1 | C12.1 6.99,66.52 | 6.99,66.52 9.38,64.13 23.5,64.13 IC11.10 R25.2 R1.2 R2.2 | 79.38,65.41 C9.1 C18.1 72.57,63.32 69.67,63.32 C13.1 67.97,62.23 64.95,59.2 64.95,57.96 C15.1 | XH.2 77.17,69.22 79.38,67.02 79.38,65.41 | IC5.8 53.24,17.14 R13.1 | IC10.19 22.86,8.26 IC10.1 IC8.8 | C-1.1 48.89,2.54 ..1 | IC1.7 83.41,2.76 C-2.1 | IC8.13 40.01,15.88 C10.1 | OUT2.10 8.04,14.61 C37.1
  Bottom 0.254: 74.93,45.72 C17.1 79.38,48.26 C-12.1 82.25,50.51 IC4.7 | 74.93,45.72 C16.1 69.85,45.72 C1.1 | 73.48,31.75 73.48,44.27 74.93,45.72 | 73.48,31.75 73.66,31.75 C-11.1 76.83,29.21 C5.1 82.25,34.63 IC3.7 | C6.1 73.48,31.75 | 97,39.05 IN1.10 | IN2.1 97,39.05 | 90.81,39.05 C20.1 90.64,41.45 INPUT2.1 | C35.1 90.81,39.05 | 90.81,39.05 97,39.05 | C13.1 66.85,63.96 63.14,63.96 59.05,68.04 C23.1 | 25.4,29.84 28.57,29.84 IC7.8 | 25.4,29.84 24.77,29.84 C26.1 C25.1 | IC10.10 25.4,29.84 | C-2.1 88.9,8.26 C19.1 90.64,14.44 90.64,14.57 | 75.74,79.38 75.74,83.36 AH.2 | 75.74,79.38 75.74,75.39 YH.2 75.74,73.2 75.74,70.31 XH.2 | ZH.2 75.74,79.38 | 97,67.17 97,72.23 FIN.1 | IN2.10 97,67.17 | C32.1 88.76,67.17 97,67.17 | INPUT1.1 90.64,14.57 | 90.64,14.57 IN1.1 | C-10.1 67.64,29.21 63.26,24.83 60.53,24.83 59.45,23.74 | 59.45,23.74 C14.1 | IC5.8 59.45,23.74 | IC10.19 15.88,8.26 C37.1 | OUT1.1 3.46,65.41 9.53,59.34 OUTPUT1.1 | 46.23,16 C7.- 46.23,5.2 ..1 | 46.23,16 C10.1 C11.1 43.18,27.94 IC12.7 38.73,32.38 38.73,38.73 IC7.13 | R13.1 47.37,17.14 46.23,16 | C4.1 69.22,13.34 C2.1 74.3,13.34 C3.1 | C24.1 C8.1 43.18,54.61 R2.2 | OUTPUT2.1 C27.1 | 31.75,2.86 31.75,10.79 IC8.13 | 31.75,2.86 C36.1 | IC8.8 31.75,3.17 31.75,2.86 | DC1.1 C12.1 | IC2.7 C-3.1 | IC6.8 59.69,50.4 63.5,54.21 C15.1
I2
  Top 0.254: RN5.9 IC13.18
  Bottom 0.254: X.2 20.32,66.04 RN5.9
I3
  Top 0.254: IC13.17 RN5.8 22.78,70.56 17.22,70.56 X.3
I4
  Top 0.254: IC13.16 RN5.7 22.23,71.12 Y.2
I5
  Top 0.254: Y.3 17.2,77.52 20.9,77.52 RN5.6 IC13.15
I6
  Top 0.254: RN5.5 IC13.14
  Bottom 0.254: Z.2 24.13,76.2 RN5.5
I7
  Top 0.254: IC13.13 RN5.4 19.05,78.74 Z.3
I8
  Top 0.254: IC13.12 RN5.3 17.78,88.27 A.2
I9
  Top 0.254: A.3 17.21,91.51 18.29,91.51 19.05,90.75 19.05,88.34 23.57,83.82 RN5.2 IC13.11
I12
  Top 0.254: RN1.2 69.28,5.57 IC1.3
  Bottom 0.254: RN1.2 62.37,6.84 53.09,6.84 IC5.15
I13
  Top 0.254: IC1.6 75.53,6.95 64.8,6.95 RN1.3 61.98,8.11 IC5.1
I14
  Top 0.254: IC1.8 82.25,9.89 79.88,7.51 66.78,7.51 RN1.4 61.98,10.65 IC5.2
I15
  Top 0.254: IC1.11 72.88,8.63 69.06,8.63 68.11,9.58 68.11,11.51 66.42,13.19 RN1.5 61.98,13.19 IC5.3
I16
  Top 0.254: IC2.6 77.96,17.01 75.56,17.01 73.3,14.75 64.61,14.75 RN1.6 61.98,15.73 IC5.4
I17
  Top 0.254: IC2.3 70.3,16.97 64.94,16.97 RN1.7 61.98,18.27 IC5.5
I18
  Bottom 0.254: IC5.6 61.98,20.81 RN1.8 67.11,24.28 80.16,24.28 IC2.8
I19
  Top 0.254: IC5.7 61.98,23.35 RN1.9 71.61,23.35 IC2.11
I22
  Top 0.254: IC3.3 72.09,33.63 69.11,30.65 65.58,30.65 RN4.2 62.96,31.93 53.16,31.93 IC6.15
I23
  Top 0.254: RN4.3 65.77,33 70.04,33 70.83,33.79 70.83,35.75 71.62,36.54 77.94,36.54 IC3.6
  Bottom 0.254: RN4.3 61.57,33.08 61.57,32.36 IC6.1
I24
  Top 0.254: IC3.8 77.56,37.68 RN4.4 61.57,35.62 61.57,34.9 IC6.2
I25
  Top 0.254: RN4.5 72.47,40.22 IC3.11
  Bottom 0.254: RN4.5 61.57,38.16 61.57,37.44 IC6.3
I26
  Top 0.254: IC4.6 77.72,49.4 75.17,49.4 72.77,46.99 67.86,46.99 RN4.6 61.57,40.7 61.57,39.98 IC6.4
I27
  Top 0.254: RN4.7 67.73,49.4 70.09,49.4 IC4.3
  Bottom 0.254: RN4.7 61.57,43.24 61.57,42.52 IC6.5
I28
  Top 0.254: RN4.8 61.57,45.78 61.57,45.06 IC6.6
  Bottom 0.254: RN4.8 65.76,47.84 68.28,50.36 68.28,52.37 72.57,56.65 79.89,56.65 IC4.8
I29
  Top 0.254: RN4.9 69.97,56.71 72.33,56.71 IC4.11
  Bottom 0.254: RN4.9 61.57,48.32 61.57,47.6 IC6.7
IC9
  Bottom 0.254: IC11.15 23.31,46.54 23.31,41.76 24.57,40.49 26.55,40.49 27.32,39.72 27.32,37.45 IC7.6
IN1-2
  Top 0.254: INPUT1.2 90.64,17.11 IN1.2
  Bottom 0.254: INPUT1.2 80.63,12.19 79.28,12.19 78.44,11.35 78.44,9.39 74.67,5.62 69.87,5.62 IC1.1
IN1-3
  Bottom 0.254: 91.09,21.73 93.17,19.65 IN1.3 | INPUT1.3 91.09,21.73 | 91.09,21.73 89.36,20.01 89.36,19.25 82.35,12.24 81.84,12.24 80.98,11.38 80.98,9.11 IC1.4
IN1-4
  Top 0.254: INPUT1.4 89.3,23.4 95.79,23.4 IN1.4
  Bottom 0.254: INPUT1.4 80.51,14.61 79.09,14.61 77.17,12.69 IC1.10
IN1-5
  Top 0.254: IC1.13 71.42,12.24 72.49,12.24 74.85,14.61 76.47,14.61 78.86,16.99 82.7,16.99 85.16,19.44 85.16,20.91 87.61,23.37 88.48,23.37 89.84,24.73 INPUT1.5 IN1.5
IN1-6
  Bottom 0.254: IC2.4 77.47,21.6 84.97,21.6 INPUT1.6 89.36,26 95.49,26 96.76,27.27 IN1.6
IN1-7
  Bottom 0.254: IN1.7 93.17,29.81 INPUT1.7 89.84,27.27 88.58,26 84.88,26 82.6,23.72 71.98,23.72 IC2.1
IN1-8
  Top 0.254: IN1.8 95.42,32.35 91.61,28.54 89.36,28.54 INPUT1.8 85.43,24.61 78.95,24.61 IC2.10
IN1-9
  Top 0.254: 90.64,30.97 94.55,34.89 IN1.9 | INPUT1.9 90.64,30.97 | 90.64,30.97 87.27,30.97 86.77,30.48 71.47,30.48 69.56,28.57 IC2.13
IN2-2
  Top 0.254: 88.09,45.11 INPUT2.2 | IC3.1 69.35,37.1 80.08,37.1 88.09,45.11 | 88.09,45.11 IN2.2
IN2-3
  Bottom 0.254: 91.06,50.4 93.81,47.65 IN2.3 | INPUT2.3 91.06,50.4 | 91.06,50.4 89.36,48.69 89.36,47.28 79.2,37.12 77,37.12 IC3.4
IN2-4
  Top 0.254: IC3.10 79.23,44.44 81.71,44.44 INPUT2.4 89.29,49.63 96.44,49.63 IN2.4
IN2-5
  Top 0.254: IC3.13 71.61,44.44 73.9,44.44 76.46,46.99 82.16,46.99 87.26,52.09 89.36,52.09 INPUT2.5 96.36,53.37 IN2.5
IN2-6
  Top 0.254: IC4.4 76.61,53.37 INPUT2.6 89.29,54.56 96.29,54.56 IN2.6
IN2-7
  Top 0.254: IN2.7 95.79,56.6 91.33,56.6 INPUT2.7 89.84,55.91 88.65,54.71 70.33,54.71 IC4.1
IN2-8
  Top 0.254: 88.09,56.23 79.95,56.23 IC4.10 | IN2.8 94.76,60.35 91.59,57.17 89.03,57.17 88.09,56.23 | INPUT2.8 88.09,56.23
IN2-9
  Top 0.254: IC4.13 71.32,60.78 88.3,60.78 INPUT2.9 95.08,62.89 IN2.9
IN-10
  Bottom 0.254: FIN.2 96.06,73.83 91.58,73.83 87.95,77.46 87.95,82.22 IC15.1
IN-11
  Top 0.254: IC15.4 86.22,76.34 96.02,76.34 FIN.3
IN-12
  Bottom 0.254: IC15.10 94.67,76.89 94.67,77.84 96.83,80.01 FIN.4
IN-13
  Top 0.254: IC15.13 FIN.5
N$1
  Bottom 0.254: IC1.5 82.03,7.62 C-2.2
N$2
  Top 0.254: RN2.2 83.04,75.42 83.04,77.96 IC15.3
  Bottom 0.254: XH.1 77.17,66.67 79.25,68.75 79.25,71.63 RN2.2
N$3
  Bottom 0.254: IC3.2 69.56,32.73 C-10.2
N$4
  Top 0.254: R22.1 IC14.6
N$5
  Bottom 0.254: IC4.5 76.83,51.05 C17.2
N$6
  Top 0.254: ZH.1 79.38,76.83 RN2.4
  Bottom 0.254: RN2.4 83.82,76.2 86.36,76.2 IC15.8
N$7
  Top 0.254: IC1.9 79.38,10.72 C-3.2
N$8
  Top 0.254: IC15.11 88.9,81.28 RN2.5 77.47,81.28 AH.1
N$9
  Top 0.254: IC15.5 83.33,73.17 83.33,69.99 C33.2
N$10
  Bottom 0.254: IC4.2 69.22,51.05 C1.2
N$11
  Bottom 0.254: IC4.9 79.72,61.26 C9.2
N$12
  Bottom 0.254: IC4.12 72.09,61.26 C18.2
N$13
  Top 0.254: IC15.2 83.19,82.55 C34.2
N$14
  Top 0.254: IC15.9 90.17,69.85 C32.2
N$15
  Bottom 0.254: IC15.12 88.9,83.82 C31.2
N$19
  Bottom 0.254: IC1.12 71.75,10.72 C2.2
N$20
  Bottom 0.254: IC2.2 69.56,16.85 C4.2
N$21
  Bottom 0.254: IC2.9 79.38,26.72 C5.2
N$22
  Bottom 0.254: IC2.12 71.75,26.72 C6.2
N$23
  Top 0.254: IC1.2 67.76,0.97 58.09,0.97 C-1.2
N$24
  Bottom 0.254: IC2.5 77.17,16.85 C3.2
N$26
  Top 0.254: YH.1 77.17,71.75 81.28,75.86 RN2.3
  Bottom 0.254: RN2.3 IC15.6
N$27
  Bottom 0.254: R12.2 LED2.K
N$28
  Top 0.254: R13.2 42.55,21.59 LED1.K
N$29
  Bottom 0.254: S-OUT.2 49.53,65.41 R22.2
N$30
  Top 0.254: RCLK1.3 43.32,55.11 36.06,55.11 R1.1
  Bottom 0.254: R1.1 33.02,47.32 36.04,44.3 37.98,44.3 38.73,43.54 38.73,42.55 IC12.3
N$31
  Bottom 0.254: RCLK1.2 44.45,65.41 R23.2
N$32
  Top 0.254: 44.28,50.63 46.56,50.63 49.53,53.6 S-OUT.3 | R25.1 31.92,50.63 44.28,50.63 | 44.28,50.63 44.28,49.08 40.91,45.72 IC12.1
N$33
  Bottom 0.254: 39.37,52.07 39.37,49.25 44.45,44.17 44.45,36.83 IC12.9 | SRCLK1.3 39.37,52.07 | 39.37,52.07 R2.1
N$35
  Bottom 0.254: SRCLK1.2 39.37,64.77 R21.2
N$39
  Bottom 0.254: IC3.5 77.17,32.73 C-11.2
N$40
  Bottom 0.254: IC3.9 79.72,45.42 C-12.2
N$42
  Bottom 0.254: IC3.12 72.39,42.67 C16.2
N$43
  Bottom 0.254: R19.1 54.86,47.24 54.86,43.74 53.02,41.91 49.53,41.91 IC12.12
N$54
  Top 0.254: R21.1 41.74,77.31 41.74,80.48 IC14.11
N$56
  Bottom 0.254: R23.1 46.81,77.93 46.81,80.15 51.22,84.56 53.45,84.56 IC14.8
N$59
  Top 0.254: S-INPUT.2 54.61,61.93 56.7,64.03 59.16,64.03 R19.2
NXT595
  Bottom 0.254: IC8.14 35.07,20.18 35.07,24.36 36.83,26.12 IC7.9
NXT597
  Bottom 0.254: IC6.14 50.3,33.79 50.3,24.87 IC5.9
O12
  Top 0.254: IC11.13 21.59,53.34 26.34,53.34 33.95,45.72 IC7.15
O13
  Bottom 0.254: IC11.11 20.32,59.69 20.32,57.48 24.28,53.52 26.26,53.52 29.21,50.57 IC7.1
O14
  Bottom 0.254: IC11.8 28.27,54.28 28.27,52.3 30.98,49.59 30.98,47.49 IC7.2
O15
  Top 0.254: IC11.6 27.16,50.31 27.16,45.23 IC7.3
O16
  Bottom 0.254: IC11.4 27.15,45.24 27.15,42.7 IC7.4
O17
  Top 0.254: IC11.2 IC7.5
O19
  Bottom 0.254: IC11.17 19.53,45.24 19.53,42.7 IC7.7
O22
  Top 0.254: IC10.13 19.05,22.23 35.56,22.23 IC8.15
O23
  Bottom 0.254: IC10.11 19.33,28.57 23.14,24.77 27.94,24.77 IC8.1
O24
  Bottom 0.254: IC10.8 27.94,20.95 IC8.2
O25
  Bottom 0.254: IC10.6 IC8.3
O26
  Bottom 0.254: IC10.4 27.94,15.88 IC8.4
O27
  Bottom 0.254: IC10.2 27.3,10.16 27.3,11.43 IC8.5
O28
  Top 0.254: IC10.15 24.13,12.06 27.94,12.06 IC8.6
O29
  Top 0.254: IC10.17 21.59,9.53 27.94,9.53 IC8.7
OP12
  Top 0.254: OUTPUT1.2 7.62,62.87 OUT1.2
  Bottom 0.254: OUTPUT1.2 12.06,58.73 16.67,63.34 18.93,63.34 23.13,59.13 23.13,56.88 IC11.7
OP13
  Top 0.254: 9.53,57.15 12.43,57.15 16.07,60.79 24.3,60.79 IC11.9 | OUT1.3 5.08,60.33 8.26,57.15 9.53,57.15 | OUTPUT1.3 9.53,57.15
OP14
  Top 0.254: OUTPUT1.4 13.97,55.88 IC11.12
  Bottom 0.254: OUT1.4 3.81,57.15 10.79,57.15 OUTPUT1.4
OP15
  Top 0.254: 9.53,54.61 IC11.14 | OUT1.5 3.81,54.61 9.53,54.61 | OUTPUT1.5 9.53,54.61
OP16
  Top 0.254: IC11.16 15.88,49.53 OUTPUT1.6 10.87,52.15 3.73,52.15 OUT1.6
OP17
  Top 0.254: 9.53,50.47 3.48,50.47 OUT1.7 | IC11.18 14.24,44.45 10.79,47.9 10.79,49.2 9.53,50.47 | OUTPUT1.7 9.53,50.47
OP18
  Top 0.254: OUTPUT1.8 14.45,48.42 24.29,48.42 IC11.5
  Bottom 0.254: OUT1.8 3.63,47.62 5.53,49.53 10.79,49.53 OUTPUT1.8
OP19
  Top 0.254: IC11.3 24.29,43.34 14.45,43.34 OUTPUT1.9 6.35,45.09 OUT1.9
OP22
  Top 0.254: OUTPUT2.2 7.02,34.89 OUT2.2
  Bottom 0.254: OUTPUT2.2 14.61,27.3 19.05,27.3 IC10.7
OP23
  Top 0.254: 9.53,28.51 8.32,28.51 4.48,32.35 OUT2.3 | OUTPUT2.3 9.53,28.51 | 9.53,28.51 15.54,28.51 16.56,27.48 23.95,27.48 IC10.9
OP24
  Top 0.254: OUTPUT2.4 12.45,26.92 16.89,26.92 IC10.12
  Bottom 0.254: OUT2.4 3.24,29.81 4.48,28.57 10.79,28.57 OUTPUT2.4
OP25
  Top 0.254: OUT2.5 7.02,27.27 OUTPUT2.5 10.69,25.93 12.81,25.93 IC10.14
OP26
  Top 0.254: OUTPUT2.6 10.9,23.6 4.13,23.6 OUT2.6
  Bottom 0.254: OUTPUT2.6 15.87,20.96 15.87,17.78 IC10.16
OP27
  Bottom 0.254: IC10.18 14.72,13.85 14.72,21.21 12.55,23.38 10.68,23.38 OUTPUT2.7 3.04,22.23 OUT2.7
OP28
  Top 0.254: IC10.5 21.41,19.86 14.43,19.86 OUTPUT2.8 10.7,20.86 4.21,20.86 OUT2.8
OP29
  Top 0.254: OUTPUT2.9 14.61,14.61 20.8,14.61 24.61,10.79 IC10.3
  Bottom 0.254: OUTPUT2.9 6.95,17.11 OUT2.9
P2
  Bottom 0.254: IC13.1 36.2,63.2 38.9,60.49 42.45,60.49 43.03,61.07 43.03,65.56 54.78,77.31 56.09,77.31 62.97,84.19 62.97,89.81 DBM.2
P3
  Top 0.254: DBM.3 58.45,88.04 58.45,77.82 49.21,68.58 IC13.2
P4
  Top 0.254: IC13.3 48.26,71.12 54.74,77.6 56.37,77.6 57.35,78.58 57.35,89.71 DBM.4
P5
  Top 0.254: IC13.4 39.68,73.66 44.45,78.43 44.45,80.9 49.53,85.98 49.53,87.97 50.92,89.36 54.23,89.36 DBM.5
P6
  Bottom 0.254: IC13.5 39.5,79.51 39.5,80.52 40.11,81.13 46.91,81.13 50.9,85.12 51.15,85.12 52.1,86.07 52.1,89.97 DBM.6
P7
  Bottom 0.254: DBM.7 49.53,90.17 49.53,86.03 46.12,82.62 40.08,82.62 | 40.08,82.62 | 40.08,82.62 IC13.6
P8
  Bottom 0.254: IC13.7 39.54,84.63 43.03,84.63 44.45,86.05 44.45,87.94 47.31,90.81 DBM.8
P9
  Top 0.254: IC13.8 39.37,86.99 39.37,87.94 40.87,89.44 43.29,89.44 DBM.9
P10
  Bottom 0.254: 70.36,73.18 65.88,73.18 RN3.2 | DBM.10 41.88,93.71 43.37,95.19 66,95.19 70.88,90.32 70.88,73.7 70.36,73.18 | XH.4 70.36,67.82 70.36,73.18
P11
  Top 0.254: DBM.11 40.31,92 61.72,92 62.51,91.21 62.51,90.53 63.94,89.11 64.86,89.11 65.87,88.09 65.87,87.14 65.09,86.36 64.49,86.36 63.01,84.88 63.01,78.6 RN3.3 66.66,74.94 66.66,73.93 68.84,71.75 YH.4
P12
  Top 0.254: DBM.12 35.15,89.58 33.06,89.58 32.36,90.28 32.36,93.21 34.34,95.19 66,95.19 70.33,90.86 70.33,77.95 ZH.4 67.31,76.83 RN3.4
P13
  Top 0.254: 66.43,81.92 AH.4 | RN3.5 66.43,81.92 | 66.43,81.92 66.43,88.8 65.5,89.72 65.5,91.33 66.56,92.39 66.56,93.82 65.8,94.59 34.53,94.59 33.6,93.67 DBM.13
P14
  Bottom 0.254: IC14.5 57.8,86.37 57.8,87.3 59.28,88.78 60.87,88.78 62.41,90.31 62.41,90.96 64.79,93.34 DBM.14
P15
  Bottom 0.254: 55.77,76.2 R26.2 | DBM.15 63.82,94.58 65.82,94.58 66.56,93.85 66.56,92.84 65.21,91.49 65.21,90.31 63.68,88.78 63.68,84.11 55.77,76.2 | S-INPUT.4 56.05,55.08 56.05,65.05 56.35,65.36 56.35,75.62 55.77,76.2
P16
  Bottom 0.254: IC14.9 53.55,87 56.87,90.31 56.87,90.94 59.28,93.34 DBM.16
P17
  Bottom 0.254: IC14.12 48.59,89.86 48.59,90.94 50.16,92.51 50.16,93.68 51.06,94.58 55.84,94.58 DBM.17
PCGND
  Top 0.254: YH.3 70.32,73.19 70.32,70.32 XH.3 | 50.8,81.18 50.06,81.18 IC14.4 | IC14.7 54.08,81.18 50.8,81.18 | IC14.10 50.8,81.18 | C30.- 64.77,64.14 S-INPUT.3 | 5.9,84.51 5.9,80.46 DC1.3 | 5.9,84.51 5.66,84.51 C28.1 | Z.1 18.36,84.51 5.9,84.51 | R12.1 C29.1 | DBM.18 DBM.19 DBM.20 DBM.21 DBM.22 DBM.23 DBM.24 DBM.25
  Bottom 0.254: DBM.22 43.26,87.07 IC14.13 | IC14.10 51.54,87.73 DBM.19 | XH.3 67.31,69.22 C30.- | 20.79,87.58 20.79,84.96 20.32,84.49 | A.1 20.79,89.07 20.79,87.58 | 20.79,87.58 34.98,87.58 | 34.98,87.58 IC13.9 | DBM.25 34.98,87.58 | 20.32,84.49 17.27,84.49 16.57,83.78 16.57,79.32 Y.1 X.1 | 20.32,84.49 Z.1 | C29.1 66.04,87.63 AH.3 70.32,83.35 70.32,80.48 ZH.3 70.32,78.27 70.32,75.4 YH.3 | IC14.4 48.26,77.83 45.51,75.08 44.61,75.08 43.18,76.51 IC14.2 | IC14.7 59.69,83.19 R12.1
PCV5
  Top 0.254: LED2.A 54.79,67.49 35.06,67.49 33.41,69.14 33.41,81.53 IC13.10 26.97,86.36 21.25,92.08 15.24,92.08 A.4
  Bottom 0.254: 61.12,73.19 62.55,71.75 RN3.1 64.77,69.22 C30.+ | 61.12,73.19 61.12,80.53 64.77,84.19 C29.2 | LED2.A 60.49,73.19 61.12,73.19 | 12.7,85.72 A.4 | 12.7,85.72 Z.4 Y.4 X.4 | 12.7,85.72 C28.2 DC1.4
RCLK
  Top 0.254: IC6.12 50.8,40.64 IC12.11 46.48,36.32 46.48,34.44 | IC12.8 46.48,32.26 46.48,34.44 | 46.48,34.44 35.71,34.44 35.06,35.09 35.06,36.33 IC7.12 | IC8.12 40.13,13.34 42.52,15.73 IC5.12
  Bottom 0.254: IC12.8 49.35,29.39 49.35,18.2 IC5.12
SRCLK
  Top 0.254: IC8.11 35.07,12.56 35.07,13.79 35.74,14.46 40.14,14.46 43.95,18.27 IC5.11 | IC7.11 38.1,35.56 IC12.4 44.45,41.91 50.8,41.91 IC6.11
  Bottom 0.254: IC7.11 33.8,32.53 33.8,19.22 35.88,17.14 37.85,17.14 38.6,16.39 38.6,12.57 IC8.11
SRLD
  Top 0.254: IC12.10 50.8,38.1 IC6.13
  Bottom 0.254: IC6.13 55.07,35.1 55.07,16.44 IC5.13
V5
  Top 0.254: 75.69,70.64 75.69,82.33 76.55,83.19 78.47,83.19 81,85.72 83.44,85.72 83.9,86.18 91.62,86.18 IC15.14 FIN.6 | C13.2 66.33,62.23 74.74,70.64 75.69,70.64 | 75.69,70.64 80.8,70.64 RN2.1 | S-OUT.4 57.15,59.05 S-INPUT.1 | C37.2 15.88,5.71 IC10.20 19.04,4.46 32.42,4.46 | 22.05,34.47 C25.2 17.78,38.73 IC11.20 13.97,39.37 | 34.44,34.47 22.05,34.47 | 22.05,34.47 20.32,32.73 C26.2 | 34.44,34.47 35.88,33.02 IC7.10 | 38.62,48.26 38.62,45.25 37.82,44.45 35.85,44.45 34.44,43.04 34.44,34.47 | 38.62,48.26 39.37,48.26 C8.2 | IC7.16 38.62,48.26 | IC1.14 67.02,9.89 68.83,8.07 79.65,8.07 81.15,9.57 81.15,11.49 82.36,12.7 C19.2 | SRCLK1.4 41.91,53.65 44.01,51.55 44.9,51.55 46.99,53.64 RCLK1.4 | IC8.16 34.92,25.4 C22.2 | 13.97,39.37 C21.2 | 13.97,39.37 13.97,38.73 C27.2 | DC1.2 4.45,74.3 C12.2 | 63.63,28.52 64.87,28.52 IC2.14 | C14.2 55.83,28.52 63.63,28.52 | 63.63,28.52 RN4.1 | ..2 43.41,5.9 51.49,5.9 IC5.16 53.76,3.63 63.03,3.63 RN1.1 | IC6.16 50.05,28.46 46.88,28.46 C11.2 42.55,24.13 LED1.A | 32.42,4.46 36.22,8.26 IC8.10 | C36.2 32.42,4.41 32.42,4.46 | IC12.14 IC6.10
  Bottom 0.254: IC2.14 67.3,26.38 71.26,30.34 73.32,30.34 75.58,28.09 76.63,28.09 78.84,30.31 87.6,30.31 | RN2.1 83.35,69.05 83.35,63.19 INPUT2.10 | RN4.1 65.52,31.94 65.52,40.88 IC3.14 | 66.04,59.67 64.11,59.67 C15.2 62.51,59.05 58.56,63 | IC4.14 66.36,59.67 66.04,59.67 | 66.04,59.67 C13.2 | 58.56,63 59.05,63.5 C23.2 | S-INPUT.1 58.56,63 | 87.6,30.31 INPUT1.10 | 87.6,30.31 87.6,36.16 C35.2 C20.2 | 41.93,8.26 41.93,12.59 C7.+ 40.64,15.37 C10.2 40.64,23.5 | ..2 41.93,8.26 | 41.93,8.26 IC8.10 | 40.64,23.5 41.27,24.13 LED1.A | 40.64,23.5 IC8.16 | IC7.10 34.92,31.11 C22.2 | C12.2 10.76,64.17 10.76,58.05 11.78,57.02 12.54,57.02 13.21,56.35 13.21,49.4 OUTPUT1.10 C21.2 | IC5.10 53.98,22.96 C14.2 53.98,28.57 IC6.16 | C37.2 12.06,9.53 OUTPUT2.10 | IC12.14 48.9,46.35 C24.2 | RCLK1.4 46.99,51.44 C24.2 | RN1.1 67.02,6.41 IC1.14 | S-OUT.4 52.07,52.7 C24.2 | SRCLK1.4 41.91,50.8 C8.2
V5PC
  Top 0.254: SRCLK1.1 43,60.5 45.9,60.5 RCLK1.1 48.08,60.5 50.98,60.5 S-OUT.1 | IC14.14 IC14.1
  Bottom 0.254: SRCLK1.1 41.91,78.11 IC14.1 | S-OUT.1 52.07,62.87 R26.1

### Text on the board
tValues: 5V / Dir / Step / GND | ULN2803A | License: CERN-OHL-P V2 | info@virtualsilicon.ch | 156-01A LCNC Combo board | +5 | -